# EAGLE design band-motor-feather (EAGLE 8.2.1)
DATABASE: /Users/ingolia/Dropbox/Experiments/turbidostat/nephelometer/circuitry/partsdb.txt
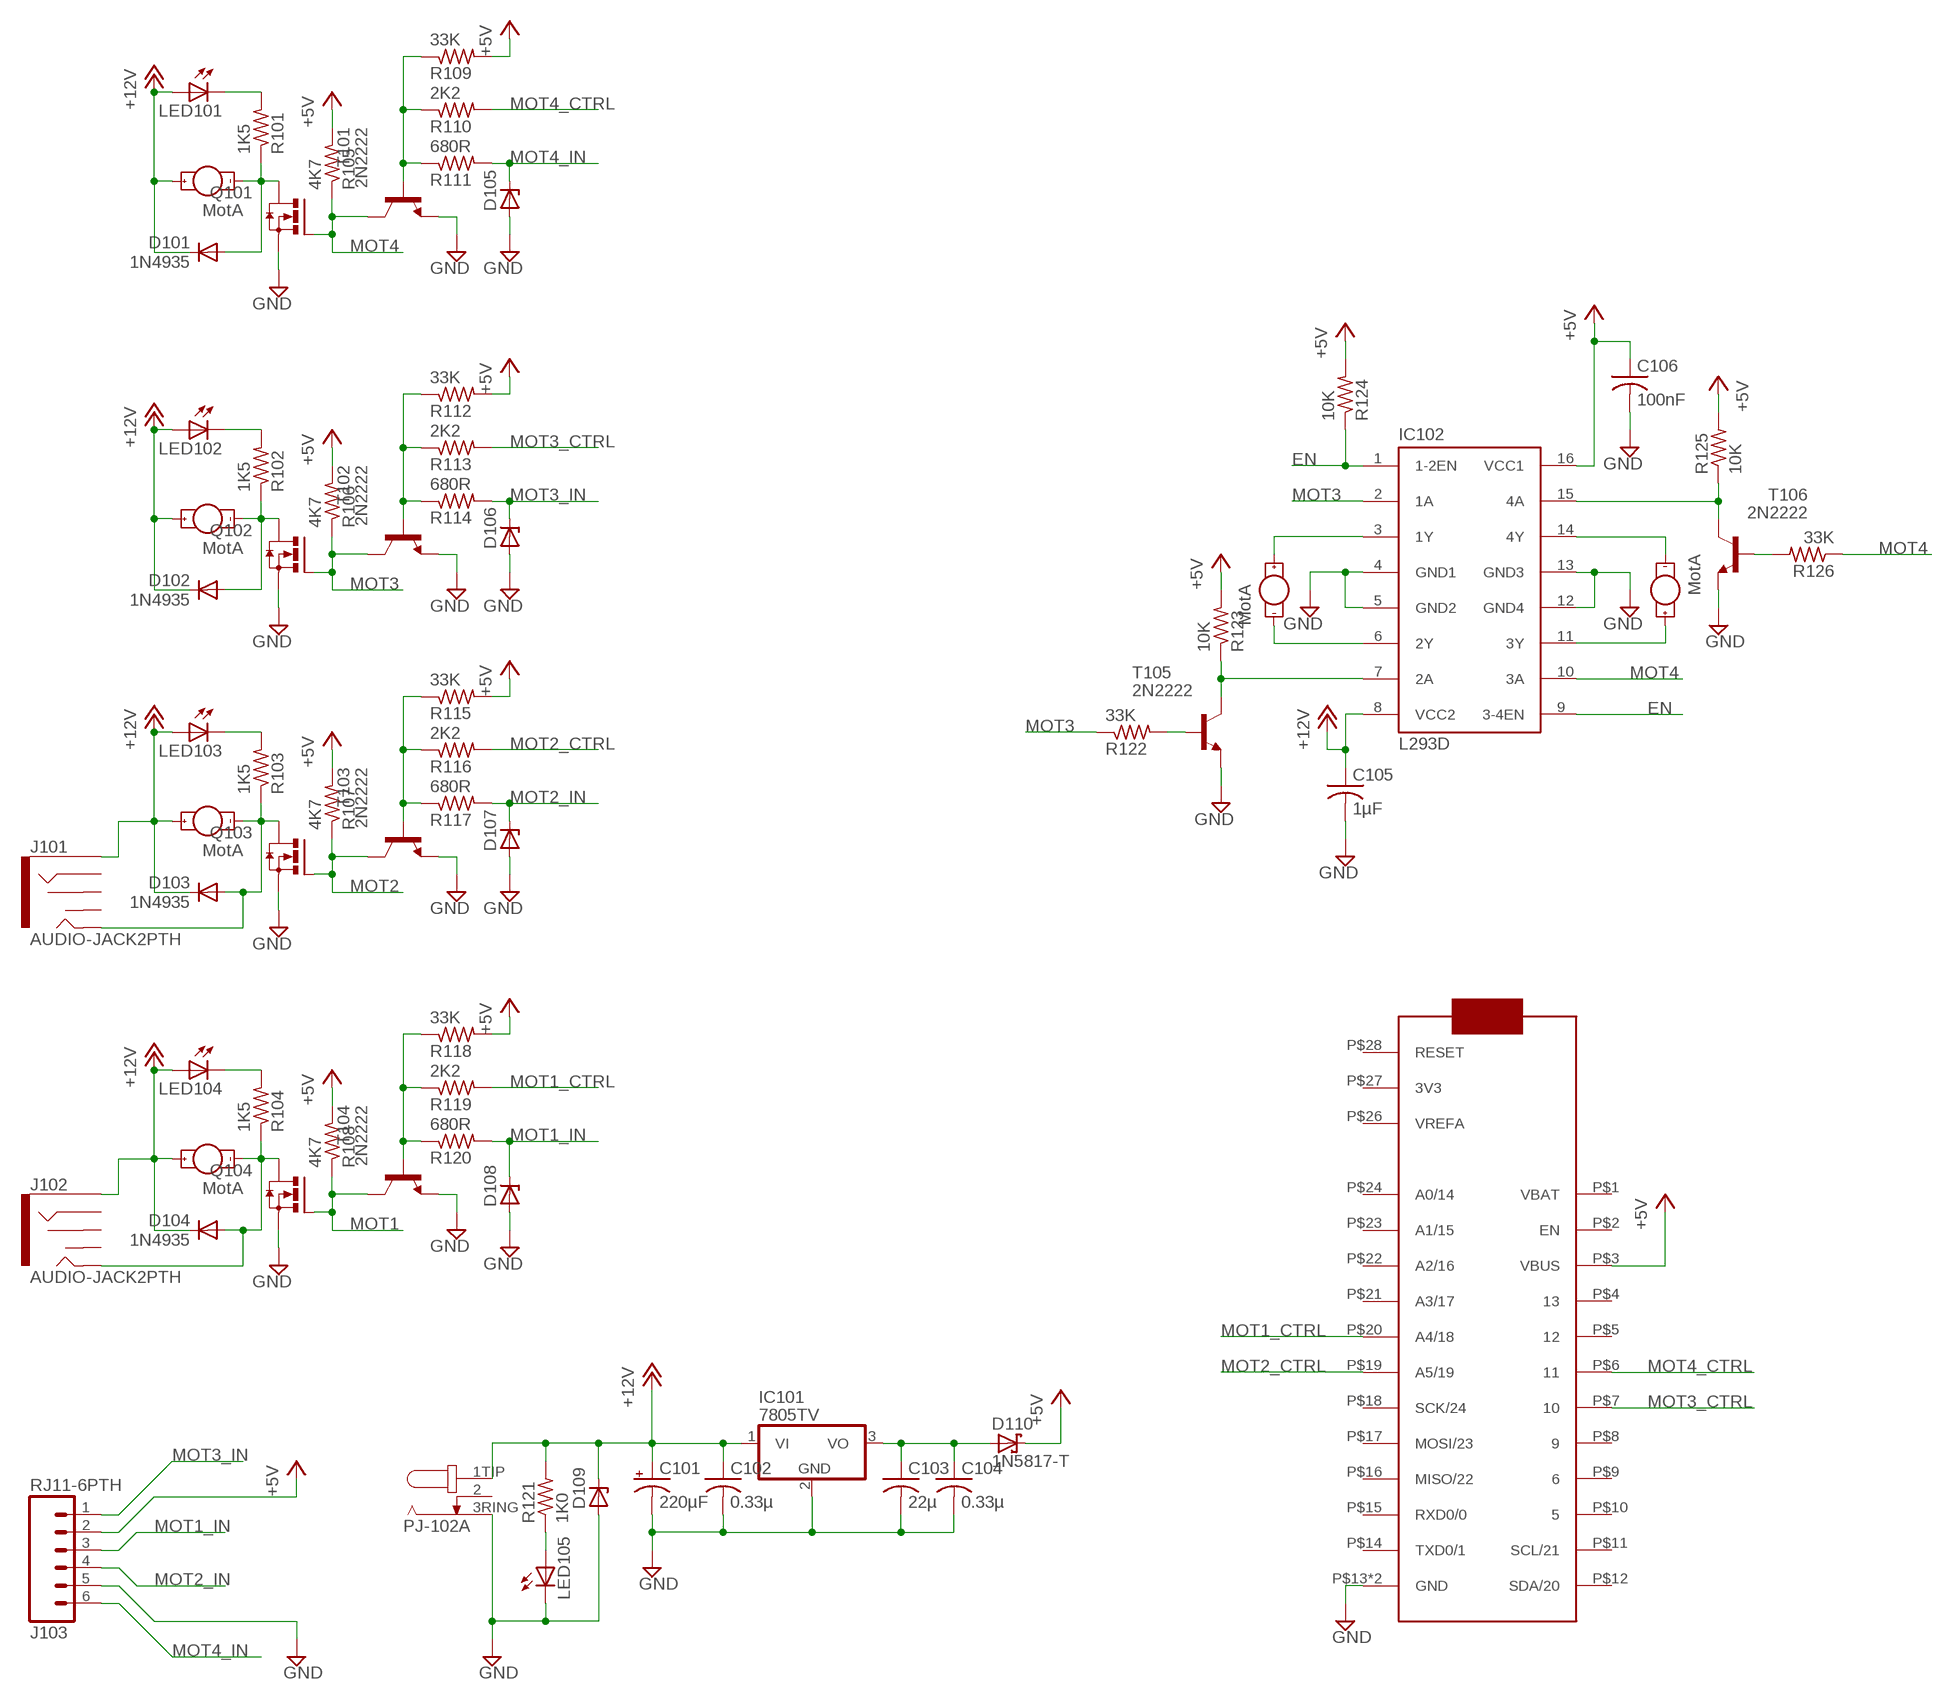
[diagram p0: schematic, sheet 1]

## Parts
C101  220µF  CPOL-USE3.5-8  [E3,5-8]
C102  0.33µ  C-US025-050X050  [C025-050X050]
C103  22µ  C-US050-045X075  [C050-045X075]
C104  0.33µ  C-US025-050X050  [C025-050X050]
C105  1µF  C-US025-025X050  [C025-025X050]
C106  100nF  C-US025-025X050  [C025-025X050]
D101  1N4935  1N4004  [DO41-10]
D102  1N4935  1N4004  [DO41-10]
D103  1N4935  1N4004  [DO41-10]
D104  1N4935  1N4004  [DO41-10]
D105  ZENER-DIODEF126-10  [F126Z10]
D106  ZENER-DIODEF126-10  [F126Z10]
D107  ZENER-DIODEF126-10  [F126Z10]
D108  ZENER-DIODEF126-10  [F126Z10]
D109  ZENER-DIODEF126-10  [F126Z10]
D110  1N5817-T  [DO41-7.6]
IC101  7805TV  [TO220V]
IC102  L293D  [DIL16]
IC103  FEATHER_M0  [FEATHER_M0]
J101  AUDIO-JACK2PTH  [AUDIO-JACK]
J102  AUDIO-JACK2PTH  [AUDIO-JACK]
J103  RJ11-6PTH  [RJ11-6]
J104  MotA  1X02_3.5MM_MOT  [1X02_3.5MM_MOT]
J105  MotA  1X02_3.5MM_MOT  [1X02_3.5MM_MOT]
J106  MotA  1X02_3.5MM_MOT  [1X02_3.5MM_MOT]
J107  MotA  1X02_3.5MM_MOT  [1X02_3.5MM_MOT]
J108  PJ-102A  [PJ-102A]
J109  MotA  1X02_3.5MM_MOT  [1X02_3.5MM_MOT]
J110  MotA  1X02_3.5MM_MOT  [1X02_3.5MM_MOT]
LED101  LED3MM  [LED3MM]
LED102  LED3MM  [LED3MM]
LED103  LED3MM  [LED3MM]
LED104  LED3MM  [LED3MM]
LED105  LED5MM  [LED5MM]
Q101  IRLB8721  [TO220BV]
Q102  IRLB8721  [TO220BV]
Q103  IRLB8721  [TO220BV]
Q104  IRLB8721  [TO220BV]
R101  1K5  R-US_0207/10  [0207/10]
R102  1K5  R-US_0207/10  [0207/10]
R103  1K5  R-US_0207/10  [0207/10]
R104  1K5  R-US_0207/10  [0207/10]
R105  4K7  R-US_0207/10  [0207/10]
R106  4K7  R-US_0207/10  [0207/10]
R107  4K7  R-US_0207/10  [0207/10]
R108  4K7  R-US_0207/10  [0207/10]
R109  33K  R-US_0207/10  [0207/10]
R110  2K2  R-US_0207/10  [0207/10]
R111  680R  R-US_0207/10  [0207/10]
R112  33K  R-US_0207/10  [0207/10]
R113  2K2  R-US_0207/10  [0207/10]
R114  680R  R-US_0207/10  [0207/10]
R115  33K  R-US_0207/10  [0207/10]
R116  2K2  R-US_0207/10  [0207/10]
R117  680R  R-US_0207/10  [0207/10]
R118  33K  R-US_0207/10  [0207/10]
R119  2K2  R-US_0207/10  [0207/10]
R120  680R  R-US_0207/10  [0207/10]
R121  1K0  R-US_0207/9  [0207/9]
R122  33K  R-US_0207/10  [0207/10]
R123  10K  R-US_0207/10  [0207/10]
R124  10K  R-US_0207/10  [0207/10]
R125  10K  R-US_0207/10  [0207/10]
R126  33K  R-US_0207/10  [0207/10]
T101  2N2222  [TO92-EBC-OVAL]
T102  2N2222  [TO92-EBC-OVAL]
T103  2N2222  [TO92-EBC-OVAL]
T104  2N2222  [TO92-EBC-OVAL]
T105  2N2222  [TO92-EBC-OVAL]
T106  2N2222  [TO92-EBC-OVAL]

## Nets
+5V: C106.1 D110.C IC102.16(VCC1) IC103.P$3(VBUS) J103.2 R105.2 R106.2 R107.2 R108.2 R109.2 R112.2 R115.2 R118.2 R123.2 R124.2 R125.2
+12V: C101.+ C102.1 C105.1 D101.C D102.C D103.C D104.C D109.C IC101.1(VI) IC102.8(VCC2) J101.SLEEVE J102.SLEEVE J104.1A(+) J105.1A(+) J106.1A(+) J107.1A(+) J108.1TIP(3TIP) LED101.A LED102.A LED103.A LED104.A R121.2
EN: IC102.1(1-2EN) IC102.9(3-4EN) R124.1
GND: C101.- C102.2 C103.2 C104.2 C105.2 C106.2 D105.A D106.A D107.A D108.A D109.A IC101.2(GND) IC102.4(GND1) IC102.5(GND2) IC102.12(GND4) IC102.13(GND3) IC103.P$13(GND) IC103.P$25(GND) J103.5 J108.3RING(1RING) LED105.K(C) Q101.S Q102.S Q103.S Q104.S T101.E T102.E T103.E T104.E T105.E T106.E
MOT1: Q104.G R108.1 T104.C
MOT1_CTRL: IC103.P$20(A4/18) R119.2
MOT1_IN: D108.C J103.3 R120.2
MOT2: Q103.G R107.1 T103.C
MOT2_CTRL: IC103.P$19(A5/19) R116.2
MOT2_IN: D107.C J103.4 R117.2
MOT3: IC102.2(1A) Q102.G R106.1 R122.1 T102.C
MOT3_CTRL: IC103.P$7 R113.2
MOT3_IN: D106.C J103.1 R114.2
MOT4: IC102.10(3A) Q101.G R105.1 R126.1 T101.C
MOT4_CTRL: IC103.P$6 R110.2
MOT4_IN: D105.C J103.6 R111.2
N$1: LED105.A R121.1
N$2: C103.1 C104.1 D110.A IC101.3(VO)
N$3: D103.A J101.TIP J106.2K(-) Q103.D R103.1
N$4: D104.A J102.TIP J107.2K(-) Q104.D R104.1
N$5: LED104.K(C) R104.2
N$6: R118.1 R119.1 R120.1 T104.B
N$7: LED103.K(C) R103.2
N$8: R112.1 R113.1 R114.1 T102.B
N$9: R109.1 R110.1 R111.1 T101.B
N$10: R115.1 R116.1 R117.1 T103.B
N$11: IC102.15(4A) R125.1 T106.C
N$12: R126.2 T106.B
N$13: IC102.7(2A) R123.1 T105.C
N$14: R122.2 T105.B
N$15: IC102.3(1Y) J109.1A(+)
N$16: IC102.6(2Y) J109.2K(-)
N$18: IC102.14(4Y) J110.2K(-)
N$19: IC102.11(3Y) J110.1A(+)
N$20: D102.A J105.2K(-) Q102.D R102.1
N$21: LED102.K(C) R102.2
N$22: D101.A J104.2K(-) Q101.D R101.1
N$23: LED101.K(C) R101.2
Unconnected: IC103.P$1(VBAT) IC103.P$2(EN) IC103.P$4 IC103.P$5 IC103.P$8 IC103.P$9 IC103.P$10 IC103.P$11(SCL/21) IC103.P$12(SDA/20) IC103.P$14(TXD0/1) IC103.P$15(RXD0/0) IC103.P$16(MISO/22) IC103.P$17(MOSI/23) IC103.P$18(SCK/24) IC103.P$21(A3/17) IC103.P$22(A2/16) IC103.P$23(A1/15) IC103.P$24(A0/14) IC103.P$26(VREFA) IC103.P$27(3V3) IC103.P$28(RESET) J101.RING J101.RSH J101.TSH J102.RING J102.RSH J102.TSH J108.2

## Library data of the parts
C101 = adafruit:CPOL-US: POLARIZED CAPACITOR, American symbol; DIGIKEY#: P5166-ND; MANF: Panasonic Electronic Components; MANF#: ECA-1VM221
C102 C104 = adafruit:C-US: CAPACITOR, American symbol; DIGIKEY#: 445-5312-ND; MANF: TDK Corporation; MANF#: FK14X7R1H334K
C103 = adafruit:C-US: CAPACITOR, American symbol; DIGIKEY#: 445-8455-ND; MANF: TDK Corporation; MANF#: FK20X7R1C226M
C105 = adafruit:C-US: CAPACITOR, American symbol; DIGIKEY#: 445-5318-ND; MANF: TDK Corporation; MANF#: FK14X7R1C105K
C106 = adafruit:C-US: CAPACITOR, American symbol; DIGIKEY#: BC1084CT-ND; MANF: Vishay BC Components; MANF#: K104K15X7RF5TL2
D101-D104 = adafruit:1N4004: DIODE General purpose 1N400x type rectifier (With bigger pads) http://www.ladyada.net/library/pcb/eaglelibrary.html; DIGIKEY#: 1N4935FSCT-ND; MANF: Fairchild Semiconductor; MANF#: 1N4935
D105-D108 = diode:ZENER-DIODE: Z-Diode; DIGIKEY#: SA5.0ALFCT-ND; MANF: Littelfuse Inc.; MANF#: SA5.0A
D109 = diode:ZENER-DIODE: Z-Diode; DIGIKEY#: SA12ALFCT-ND; MANF: Littelfuse Inc.; MANF#: SA12A
D110 = diode:1N581*: 1.0A SCHOTTKY BARRIER RECTIFIER Source: http://www.diodes.com/datasheets/ds23001.pdf; DIGIKEY#: 1N5817FSCT-ND; MANF: Fairchild Semiconductor; MANF#: 1N5817
IC101 = linear:78*: Positive VOLTAGE REGULATOR Source: http://cache.national.com/ds/LM/LM78L05.pdf http://www.fairchildsemi.com/ds/LM/LM7805.pdf; DIGIKEY#: LM7805CT-ND; MANF: Fairchild Semiconductor; MANF#: LM7805CT
IC102 = st-microelectronics:L293D: PUSH-PULL 4 CHANNEL DRIVER; DIGIKEY#: 296-9518-5-ND; MANF: Texas Instruments; MANF#: L293DNE; MPN: L293D; OC_FARNELL: 9589619; OC_NEWARK: 56P8249
IC103 = ingolia:FEATHER_M0; DIGIKEY#: 2830-ND; MANF: Adafruit Industries LLC; MANF#: 2830
J101 J102 = SparkFun-Connectors:AUDIO-JACK2: Stereo audio jack with bypass switches.; DIGIKEY#: CP1-3523N-ND; MANF: CUI Inc.; MANF#: SJ1-3523N
J103 = SparkFun-Connectors:RJ11-6: RJ11 Jack Simple 6 pin RJ11 jack. Commonly found on CAT3 devices and Microchip programmers. SKU: PRT-00132; DIGIKEY#: AE10383-ND; MANF: Assmann WSW Components; MANF#: -2004-1-4-LP-N-R
J104-J107 J109 J110 = ingolia:1X02_3.5MM_MOT; DIGIKEY#: ED2740-ND; MANF: On Shore Technology Inc.; MANF#: OSTTE020104
J108 = ingolia:PJ-102A; DIGIKEY#: CP-102A-ND; MANF: CUI Inc.; MANF#: PJ-102A
LED101-LED104 = adafruit:LED: LED OSRAM: - CHIPLED LG R971, LG N971, LY N971, LG Q971, LY Q971, LO R971, LY R971 LH N974, LH R974 LS Q976, LO Q976, LY Q976 LO Q996 - Hyper CHIPLED LW Q18S LB Q993, LB Q99A, LB R99A - SideLED LS A670, LO A670, LY A670, LG A670, LP A670 LB A673, LV A673, LT A673, LW A673 LH A674 LY A675 LS A676, LA A676, LO A676, LY A676, LW A676 LS A679, LY A679, LG A679 - Hyper Micro SIDELED® LS Y876, LA Y876, LO Y876, LY Y876 LT Y87S - SmartLED LW L88C, LW L88S LB L89C, LB L89S, LG L890 LS L89K, LO L89K, LY L89K LS L896, LA L896, LO L896, LY L896 - TOPLED LS T670, LO T670, LY T670, LG T670, LP T670 LSG T670, LSP T670, LSY T670, LOP T670, LYG T670 LG T671, LOG T671, LSG T671 LB T673, LV T673, LT T673, LW T673 LH T674 LS T676, LA T676, LO T676, LY T676, LB T676, LH T676, LSB T676, LW T676 LB T67C, LV T67C, LT T67C, LS T67K, LO T67K, LY T67K, LW E67C LS E67B, LA E67B, LO E67B, LY E67B, LB E67C, LV E67C, LT E67C LW T67C LS T679, LY T679, LG T679 LS T770, LO T770, LY T770, LG T770, LP T770 LB T773, LV T773, LT T773, LW T773 LH T774 LS E675, LA E675, LY E675, LS T675 LS T776, LA T776, LO T776, LY T776, LB T776 LHGB T686 LT T68C, LB T68C - Hyper Mini TOPLED® LB M676 - Mini TOPLED Santana® LG M470 LS M47K, LO M47K, LY M47K Source: http://www.osram.convergy.de/; DIGIKEY#: 754-1275-ND; MANF: Kingbright; MANF#: WP7113SRD/D
LED105 = adafruit:LED: LED OSRAM: - CHIPLED LG R971, LG N971, LY N971, LG Q971, LY Q971, LO R971, LY R971 LH N974, LH R974 LS Q976, LO Q976, LY Q976 LO Q996 - Hyper CHIPLED LW Q18S LB Q993, LB Q99A, LB R99A - SideLED LS A670, LO A670, LY A670, LG A670, LP A670 LB A673, LV A673, LT A673, LW A673 LH A674 LY A675 LS A676, LA A676, LO A676, LY A676, LW A676 LS A679, LY A679, LG A679 - Hyper Micro SIDELED® LS Y876, LA Y876, LO Y876, LY Y876 LT Y87S - SmartLED LW L88C, LW L88S LB L89C, LB L89S, LG L890 LS L89K, LO L89K, LY L89K LS L896, LA L896, LO L896, LY L896 - TOPLED LS T670, LO T670, LY T670, LG T670, LP T670 LSG T670, LSP T670, LSY T670, LOP T670, LYG T670 LG T671, LOG T671, LSG T671 LB T673, LV T673, LT T673, LW T673 LH T674 LS T676, LA T676, LO T676, LY T676, LB T676, LH T676, LSB T676, LW T676 LB T67C, LV T67C, LT T67C, LS T67K, LO T67K, LY T67K, LW E67C LS E67B, LA E67B, LO E67B, LY E67B, LB E67C, LV E67C, LT E67C LW T67C LS T679, LY T679, LG T679 LS T770, LO T770, LY T770, LG T770, LP T770 LB T773, LV T773, LT T773, LW T773 LH T774 LS E675, LA E675, LY E675, LS T675 LS T776, LA T776, LO T776, LY T776, LB T776 LHGB T686 LT T68C, LB T68C - Hyper Mini TOPLED® LB M676 - Mini TOPLED Santana® LG M470 LS M47K, LO M47K, LY M47K Source: http://www.osram.convergy.de/; DIGIKEY#: 754-1735-ND; MANF: Kingbright; MANF#: WP7113SGD
Q101-Q104 = ingolia:IRLB8721; DIGIKEY#: IRLB8721PBF-ND; MANF: International Rectifier; MANF#: IRLB8721PBF
R101-R104 = adafruit:R-US_: RESISTOR, American symbol; DIGIKEY#: CF14JT1K50CT-ND; MANF: Stackpole Electronics Inc; MANF#: CF14JT330R
R105-R108 = adafruit:R-US_: RESISTOR, American symbol; DIGIKEY#: CF14JT4K70CT-ND; MANF: Stackpole Electronics Inc; MANF#: CF14JT4K70
R109 R112 R115 R118 R122 R126 = adafruit:R-US_: RESISTOR, American symbol; DIGIKEY#: CF14JT33K0CT-ND; MANF: Stackpole Electronics Inc; MANF#: CF14JT33K0
R110 R113 R116 R119 = adafruit:R-US_: RESISTOR, American symbol; DIGIKEY#: CF14JT2K20CT-ND; MANF: Stackpole Electronics Inc; MANF#: CF14JT2K20
R111 R114 R117 R120 = adafruit:R-US_: RESISTOR, American symbol; DIGIKEY#: CF14JT680RCT-ND; MANF: Stackpole Electronics Inc; MANF#: CF14JT680R
R121 = adafruit:R-US_: RESISTOR, American symbol; DIGIKEY#: S1KHCT-ND; MANF: Stackpole Electronics Inc.; MANF#: CFM12JT1K00
R123-R125 = adafruit:R-US_: RESISTOR, American symbol; DIGIKEY#: CF14JT10K0CT-ND; MANF: Stackpole Electronics Inc; MANF#: CF14JT10K0
T101-T106 = adafruit:2N2222: NPN TRANSISTOR Big oval pads; DIGIKEY#: PN2222ATFCT-ND; MANF: Fairchild Semiconductor; MANF#: PN2222ATF

## Board
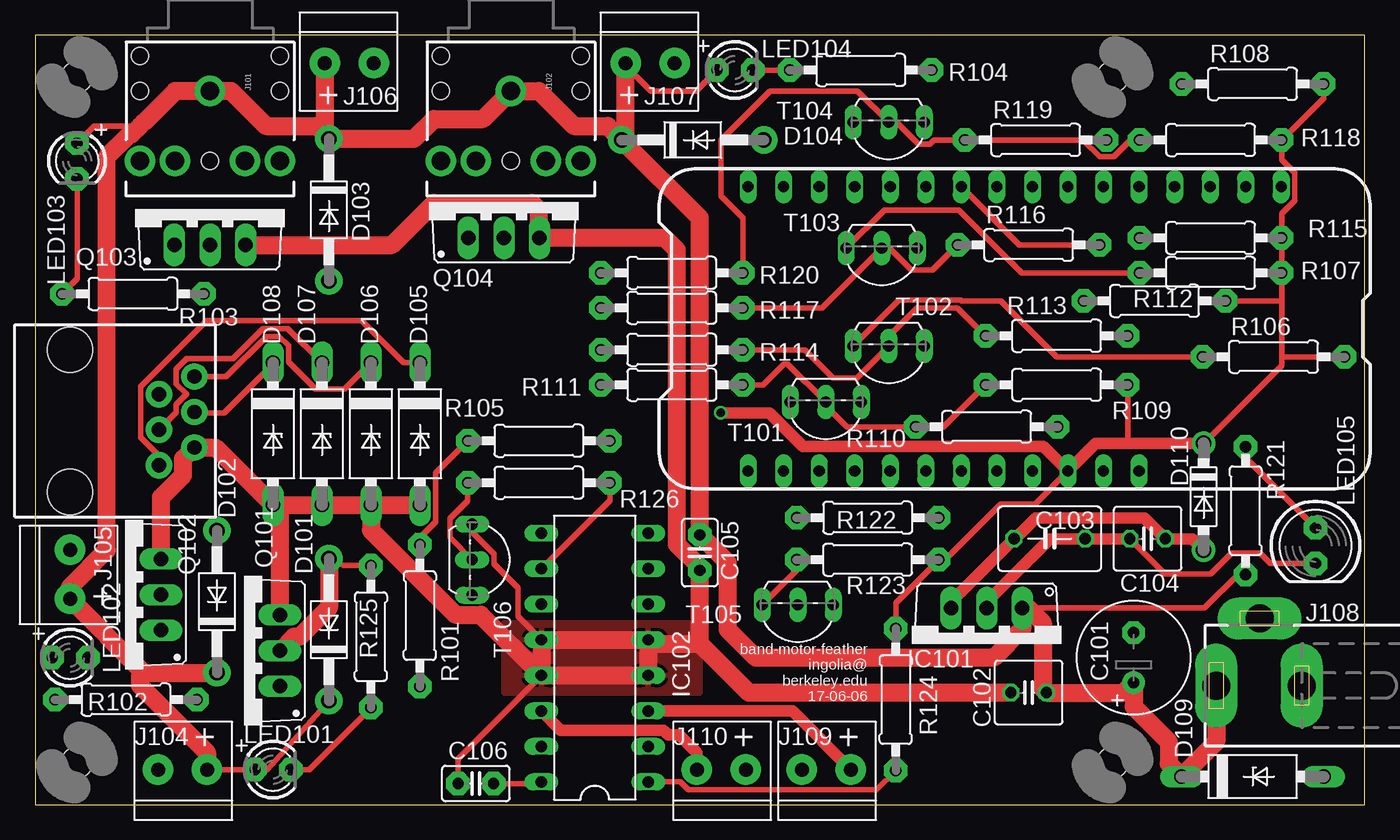
[diagram p1: board, top side]
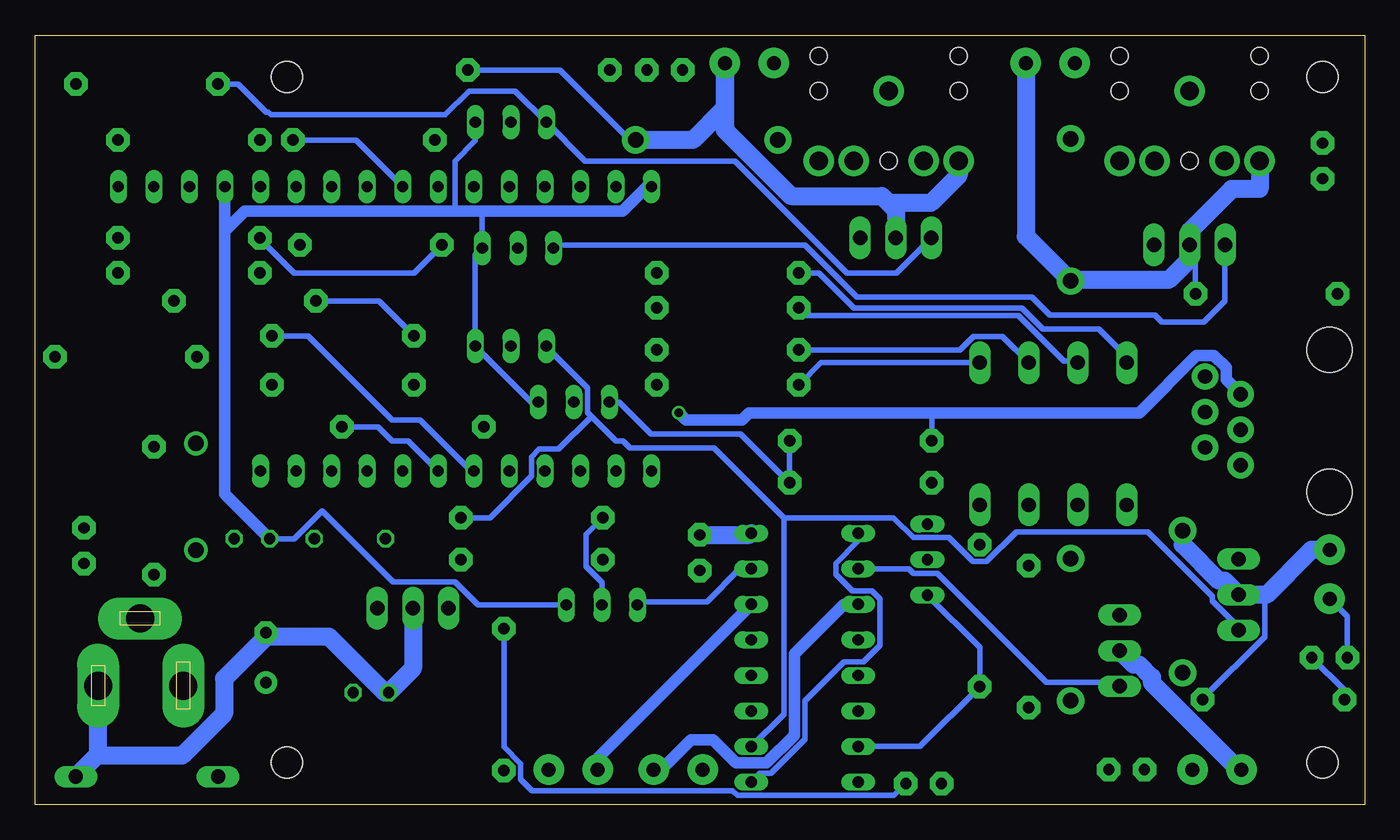
[diagram p2: board, bottom side, seen from below]

Size 95 x 55 mm. Coordinates in mm from the lower left corner, seen from the top.
Outline: 0,0 95,0 95,55 0,55 0,0
Copper layers (1*16): Top 0.0356mm / dielectric 1.5011mm / Bottom 0.0356mm
Design rules "OSHPark-LaenPCBOrder": minimum track width 6mil, minimum drill 13mil, track to track 6mil, track to pad 6mil, pad to pad 6mil, via to via 6mil, smd to smd 6mil, copper to edge 15mil, drill to drill 6mil, minimum pad ring 7mil, minimum via ring 7mil, stop-mask expansion 3mil, vias tented up to drill 0mil, thermal gap 10mil

### Footprints (pad centres in the part's own frame; a part is rotated, then mirrored left to right if it is on the bottom)
E3,5-8 = drill 0.813 pad 1.6: + -1.778,0 | drill 0.813 pad 1.6 octagon: - 1.778,0
C025-050X050 = drill 0.813 octagon: 1 -1.27,0; 2 1.27,0
C050-045X075 = drill 0.813 octagon: 1 -2.54,0; 2 2.54,0
C025-025X050 = drill 0.813 pad 1.676 octagon: 1 -1.27,0; 2 1.27,0
DO41-10 = drill 1.118 pad 1.93: A 5.08,0; C -5.08,0
F126Z10 = drill 1.016 long: A 5.08,0; C -5.08,0
DO41-7.6 = drill 1.1 pad 1.7: A 3.81,0; C -3.81,0
TO220V = drill 1.016 long: 1 -2.54,-2.54; 2 0,-2.54; 3 2.54,-2.54
DIL16 = drill 0.813 long: 1 -8.89,-3.81; 2 -6.35,-3.81; 3 -3.81,-3.81; 4 -1.27,-3.81; 5 1.27,-3.81; 6 3.81,-3.81; 7 6.35,-3.81; 8 8.89,-3.81; 9 8.89,3.81; 10 6.35,3.81; 11 3.81,3.81; 12 1.27,3.81; 13 -1.27,3.81; 14 -3.81,3.81; 15 -6.35,3.81; 16 -8.89,3.81
FEATHER_M0 = drill 0.8 long: P$1 -8.89,10.16; P$2 -6.35,10.16; P$3 -3.81,10.16; P$4 -1.27,10.16; P$5 1.27,10.16; P$6 3.81,10.16; P$7 6.35,10.16; P$8 8.89,10.16; P$9 11.43,10.16; P$10 13.97,10.16; P$11 16.51,10.16; P$12 19.05,10.16; P$13 19.05,-10.16; P$14 16.51,-10.16; P$15 13.97,-10.16; P$16 11.43,-10.16; P$17 8.89,-10.16; P$18 6.35,-10.16; P$19 3.81,-10.16; P$20 1.27,-10.16; P$21 -1.27,-10.16; P$22 -3.81,-10.16; P$23 -6.35,-10.16; P$24 -8.89,-10.16; P$25 -11.43,-10.16; P$26 -13.97,-10.16; P$27 -16.51,-10.16; P$28 -19.05,-10.16
AUDIO-JACK = drill 1.3 pad 2.184: RING 5,5; RSH 5,2.5; SLEEVE 0,0; TIP 5,-5; TSH 5,-2.5 | hole 1.2: 0,5; -2.5,5; -2.5,-5; 0,-5; 5,0
RJ11-6 = drill 1.016 pad 1.88: 1 1.905,8.89; 2 3.175,6.35; 3 4.445,8.89; 4 5.715,6.35; 5 6.985,8.89; 6 8.255,6.35 | hole 3.251: 0,0; 10.16,0
1X02_3.5MM_MOT = drill 1 pad 2.184: 1A 1.8,0; 2K -1.7,0
PJ-102A = drill 2 pad 2.54 long: 1TIP 0,3.1; 2 4.8,0; 3RING 0,-3
LED3MM = drill 0.813 pad 1.676 octagon: A -1.27,0; K 1.27,0
LED5MM = drill 0.813 pad 1.676 octagon: A -1.27,0; K 1.27,0
TO220BV = drill 1.016 long: D 0,0; G -2.54,0; S 2.54,0
0207/10 = drill 0.813 pad 1.676 octagon: 1 -5.08,0; 2 5.08,0
0207/9 = drill 0.813 pad 1.676 octagon: 1 -4.572,0; 2 4.572,0
TO92-EBC-OVAL = drill 0.813 long: B 0,-1.27; C 2.54,-1.27; E -2.54,-1.27
M2MOUNT = hole 2.2: 0,0

### Placement (x,y rotation side)
C101  78.5,10.5 90 top
C102  71,8 180 top
C103  72.5,19 0 top
C104  79.5,19 180 top
C105  47.5,18 270 top
C106  31.5,1.5 180 top
D101  21,12.5 90 top
D102  13,14.5 90 top
D103  21,42.5 270 top
D104  47,47.5 0 top
D105  27.5,26.5 270 top
D106  24,26.5 270 top
D107  20.5,26.5 270 top
D108  17,26.5 270 top
D109  87,2 0 top
D110  83.5,22 270 top
IC101  68,11.5 180 top
IC102  40,10.5 90 top
IC103  70,34 180 top
J101  12.5,51 270 top
J102  34,51 270 top
J103  2.5,32.5 270 top
J104  10.5,2.5 0 top
J105  2.5,16.5 270 top
J106  22.5,53 180 top
J107  44,53 180 top
J108  87.5,8.5 90 top
J109  56.5,2.5 0 top
J110  49,2.5 0 top
LED101  17,2.5 0 top
LED102  2.5,10.5 0 top
LED103  3,46 270 top
LED104  50,52.5 0 top
LED105  91.5,18.5 270 top
Q101  17.5,11 90 top
Q102  9,15 90 top
Q103  12.5,40 0 top
Q104  33.5,40.5 0 top
R101  24,12 270 top
R102  6.5,7.5 180 top
R103  7,36.5 180 top
R104  59,52.5 180 top
R105  36,26 180 top
R106  88.5,32 0 top
R107  84,38 0 top
R108  87,51.5 0 top
R109  73,30 0 top
R110  68,27 0 top
R111  45.5,30 180 top
R112  80,36 0 top
R113  73,33.5 0 top
R114  45.5,32.5 180 top
R115  84,40.5 0 top
R116  71,40 0 top
R117  45.5,35.5 180 top
R118  84,47.5 0 top
R119  71.5,47.5 0 top
R120  45.5,38 180 top
R121  86.5,21 270 top
R122  59.5,20.5 180 top
R123  59.5,17.5 0 top
R124  61.5,7.5 90 top
R125  27.5,13.5 90 top
R126  36,23 180 top
T101  56.5,27.5 180 top
T102  61,31.5 180 top
T103  60.5,38.5 180 top
T104  61,47.5 180 top
T105  54.5,13 180 top
T106  32.5,17.5 270 top
U$3  [M2MOUNT]  3,3 0 top
U$4  [M2MOUNT]  3,52 0 top
U$6  [M2MOUNT]  77,52 0 top
U$7  [M2MOUNT]  77,3 0 top

### Tracks (layer width: path | path; a pad name or v marks a point on that pad's centre or on a via)
+5V  (via drill 0.6)
  Top 0.406: D110.C 89.08,31.39 89.08,32 | 89.08,32 89.08,36 | R109.2 78.08,25.89 78,25.81 | R112.2 89.08,36 | IC103.P$3 71.47,21.5 69,21.5 65,17.5 R123.2 61.5,14.42 R124.2 | R108.2 92.08,50.5 R118.2 89.08,46.08 90.01,45.16 90.01,43.16 89.08,42.24 R115.2 R107.2 89.08,36 | R106.2 89.08,32 | R125.2 27.5,19.08 28.62,20.2 28.62,23.7 R105.2 | C106.1 36.08,1.5 IC102.16
  Top 0.813: D110.C 78,25.81 75.78,25.81 IC103.P$3 72.05,25.6 54.87,25.6 52.47,28 v49,28
  Bottom 0.406: R105.2 30.92,27.92 31,28 | C106.1 33.62,0.64 44.82,0.64 45.17,1 59.5,1 60.31,1.81 60.31,2.91 61.5,4.11 R124.2
  Bottom 0.813: J103.2 9.89,30.37 9.89,31.22 10.77,32.09 12.01,32.09 16.1,28 31,28 44,28 44.5,27.5 48.5,27.5 v49,28
+12V
  Top 0.406: IC101.1 83.54,14.04 86,16.5 86.43,16.5 R121.2 | J107.1A 42.2,52.8 44,51 47.23,51 LED104.A | 7.75,48.75 7.5,48.5 4.23,48.5 LED103.A | D101.C 16.58,2.5 LED101.A J104.1A
  Top 0.813: 84.5,8.5 J108.1TIP
  Top 1.27: J108.1TIP 84.4,4.48 D109.C 81,2.92 81,4.5 78.5,7 C101.+ 77.78,8 C102.1 72,8.27 72,13 70.96,14.04 IC101.1 70.54,12.54 68.5,10.5 51.5,10.5 49.5,12.5 49.5,17.27 C105.1 47.5,41.92 D104.C | D104.C 40.92,48.5 38.5,48.5 36,51 J102.SLEEVE 32,49 28.5,49 27.08,47.58 D103.C 20.54,48.04 | J107.1A 42.2,47.78 D104.C | 20.54,48.04 20.08,48.5 16.5,48.5 14,51 J101.SLEEVE 10,51 7.75,48.75 | J106.1A 20.7,48.2 20.54,48.04 | 7.5,48.5 6.88,47.88 6.72,47.88 5.14,46.3 5.14,18.18 2.5,15.54 J105.1A 7.78,9.42 | 7.78,9.42 D102.C | J104.1A 12.3,3.7 7.5,8.5 7.5,9.14 7.78,9.42
  Bottom 0.406: LED102.A 1.23,13.43 J105.1A
  Bottom 1.27: C105.1 43.93,19.27 IC102.8
EN
  Top 0.406: R124.1 60.13,1.05 46.7,1.05 46.14,1.61 IC102.1
  Bottom 0.406: IC102.1 43.2,2.22 42.4,2.22 39.98,4.64 39.98,7.42 37.2,10.2 35.79,10.2 34.62,11.37 34.62,14.71 35.18,15.27 36.59,15.27 37.77,16.45 37.77,17.25 36.19,18.82 IC102.9
GND
  Top 0.406: LED105.K 88.27,17.23 87.5,18 85.5,18 84,16.5 80.73,16.5 C104.2 | T106.E 31.23,19.48 32.8,17.9 32.8,17.2 34.5,15.5 34.5,13.46 IC102.12 | C106.2 30.23,3.27 IC102.13
  Top 0.813: IC101.2 68,14.5 72.5,19 C103.2 C104.2
  Top 1.27: Q103.S 25.5,40 28.5,43 35.5,43 36,42.5 36,40.54 Q104.S 45,40.5 45.87,39.63 45.87,18.6 47.5,16.97 C105.2 47.5,11.5 | 47.5,11.5 51,8 C102.2 | 47.5,11.5 44.08,11.5 IC102.5 | IC102.5 IC102.4 IC102.13 | IC102.13 IC102.12 IC102.5 | IC102.13 31.86,13.56 30.04,13.56 24,19.61 D106.A | D108.A 12.9,25.52 J103.5 10.58,24.7 10.58,23.53 9,21.95 Q102.S | D108.A D107.A D106.A | D106.A D105.A | Q101.S 17.5,20.92 D108.A
  Bottom 0.406: 63.54,42.36 63.5,42.4 | 63,42.4 63.04,42.36 T103.E 63.54,39.27 T102.E 59.54,28.77 T101.E | T104.E 63.54,47.46 65,46 65,42.4 | C104.2 76.5,19 74.5,21 69.42,15.92 65,15.92 63.35,14.27 T105.E
  Bottom 0.813: 81.43,41 IC103.P$25 | 81.43,41 81.43,22.2 C104.2 | IC103.P$13 51.25,44.16 53.01,42.4 63,42.4 63.5,42.4 65,42.4 80.03,42.4 81.43,41
  Bottom 1.27: 90.5,3.58 J108.3RING | 90.5,3.58 D109.A | 90.5,3.58 90.42,3.5 84.5,3.5 81.5,6.5 81.5,9 78.5,12 C101.- 78.22,12 74,12 70,8 C102.2 68,9.73 IC101.2
  pour Top: 33.5,13 47.5,13 47.5,8 33.5,8
MOT1
  Bottom 0.406: Q104.G 33.46,38 37,38 45,46 55.69,46 T104.C 60.69,51 64,51 65.7,49.3 78.12,49.3 78.32,49.5 78.5,49.5 80.5,51.5 R108.1
MOT1_CTRL
  Bottom 0.406: R119.2 72.07,47.5 IC103.P$20
MOT1_IN
  Top 0.406: D108.C 17,31.5 13.5,28 11.5,28 J103.3
  Bottom 0.406: R120.2 39,38 36.5,35.5 24.5,35.5 23,34 19,34 17,32 D108.C
MOT2
  Top 0.406: R107.1 70.5,38 66,42.5 60.69,42.5 T103.C
  Bottom 0.406: Q103.G 10,39.96 10,36 11.5,34.5 14.5,34.5 15,35 22.5,35 23.77,36.27 36.27,36.27 40,40 57.73,40 T103.C
MOT2_CTRL
  Top 0.406: R116.2 70.35,40 IC103.P$19
MOT2_IN
  Top 0.406: J103.4 10.1,28.03 10.1,28.59 10.83,29.33 10.1,30.06 10.1,31.13 10.85,31.89 14.18,31.89 16.31,34.02 18.06,34.02 D107.C
  Bottom 0.406: D107.C 21.13,31.71 21.5,31.71 24.73,34.94 39.86,34.94 R117.2
MOT3
  Top 0.406: R106.1 73,32 69,36 66.21,36 66.15,36.06 61.75,36.06 T102.C
  Bottom 0.406: 55.25,27.75 55.53,28.03 55.53,29.78 58.46,32.7 T102.C | 55.25,27.75 53.5,26 53,26 52.5,25.5 46.5,25.5 41.5,20.5 | 41.5,20.5 41.5,6.46 IC102.2 | 55.25,27.75 57.6,25.4 58.97,25.4 59.53,24.84 59.53,23.47 62.5,20.5 R122.1 | 41.5,20.5 33.66,20.5 32.24,19.07 29.68,19.07 27.99,17.39 27.01,17.39 24.89,19.5 15.5,19.5 10.88,14.88 10.88,14.54 9,12.66 Q102.G 9.04,12.5
MOT3_CTRL
  Bottom 0.406: IC103.P$7 63.84,23.84 67.5,27.5 69.5,27.5 75.5,33.5 R113.2
MOT3_IN
  Top 0.406: J103.1 13.67,30.59 16.54,33.46 17.46,33.46 18.12,32.8 18.12,31.62 20.04,29.7 22.12,29.7 D106.C
  Bottom 0.406: R114.2 28.92,32.5 27.96,33.46 25.88,33.46 D106.C
MOT4
  Top 0.406: R126.1 41.08,21.74 IC102.10
  Bottom 0.406: T101.C 53.27,28.77 51,26.5 44.58,26.5 R126.1 R105.1 | IC102.10 32.55,16.85 32.24,16.54 30.54,16.54 22.74,8.74 17.95,8.74 17.67,8.46 Q101.G
MOT4_CTRL
  Bottom 0.406: R110.2 70.5,27 69.5,26 68.35,26 IC103.P$6
MOT4_IN
  Top 0.406: D105.C 26.34,31.58 23.34,34.58 12.27,34.58 7.55,29.86 7.55,26.25 8.85,24.95 J103.6
  Bottom 0.406: D105.C 38.84,31.58 R111.2
N$1
  Top 0.406: R121.1 86.5,24.77 LED105.A
N$2
  Top 0.813: IC101.3 65.46,14.5 C103.1 70,19 71.5,20.5 79.27,20.5 C104.1 82.69,19 D110.A
N$3
  Bottom 0.406: R103.1 12.08,39.58 Q103.D
  Bottom 1.27: J101.TIP 7.5,44 9.5,44 12.5,41 Q103.D 12.5,39 14,37.5 20.92,37.5 D103.A 24.2,40.62 J106.2K
N$4
  Bottom 0.406: D104.A 52.5,47.5 57.5,52.5 R104.1
  Bottom 1.27: D104.A 48,47.5 45.7,49.8 J107.2K 45.7,48.2 41,43.5 34.5,43.5 34,43 | 34,43 33.5,42.5 Q104.D | J102.TIP 29,45 31,43 34,43
N$5
  Top 0.406: LED104.K R104.2
N$6
  Top 0.406: R120.1 50.58,41.92 49,43.5 49,47.5 52.5,51 58.77,51 T104.B 61.56,48.77 63.14,47.2 63.94,47.2 64.25,47.5 R119.1 74.89,47.5 76.09,46.31 77.07,46.31 78.27,47.5 R118.1
N$7
  Top 0.406: LED103.K 3,37.58 R103.2
N$8
  Top 0.406: R113.1 65.92,35.5 63,35.5 61,33.5 T102.B 58.73,30.5 57,30.5 55,32.5 R114.1
  Bottom 0.406: R112.1 70.42,36 R113.1
N$9
  Top 0.406: R109.1 64.92,27 R110.1 58,27 56.5,28.5 T101.B 53.77,31.5 53.5,31.5 52,30 R111.1
N$10
  Top 0.406: R117.1 56.23,35.5 T103.B 61.06,39.77 62.64,38.2 64.11,38.2 R116.1
  Bottom 0.406: R115.1 78.92,40.42 76.5,38 67.92,38 R116.1
N$11
  Bottom 0.406: IC102.15 31.77,4.15 R125.1 27.5,11.23 T106.C
N$12
  Top 0.406: R126.2 30.92,21.7 29.66,20.44 29.66,19.07 T106.B
N$13
  Top 0.406: R123.1 54.42,16.73 T105.C
  Bottom 0.406: IC102.7 44.65,16.85 47,14.5 51.73,14.5 T105.C
N$14
  Bottom 0.406: T105.B 54.5,15.89 55.61,17.01 55.61,19.31 R122.2
N$15
  Top 0.813: IC102.3 54.11,6.69 J109.1A
N$16
  Bottom 0.813: J109.2K 54.8,3.32 IC102.6
N$18
  Top 0.813: J110.2K 47.3,3.7 46,5 45.22,5 44.9,5.32 37.56,5.32 IC102.14
N$19
  Bottom 0.813: IC102.11 37.19,14.31 40.74,10.76 40.74,4.96 42.72,2.98 44.9,2.98 46.56,4.63 48.13,4.63 50.26,2.5 J110.1A
N$20
  Bottom 0.406: 7,15 7.12,14.88 7.12,12 11.58,7.54 R102.1
  Bottom 1.27: D102.A 13,18.59 10.4,15.99 9.99,15.99 Q102.D 7,15 3.8,18.2 J105.2K
N$21
  Bottom 0.406: R102.2 1.42,8.15 LED102.K
N$22
  Top 0.406: R101.1 22,17.08 D101.A
  Top 1.27: Q101.D 18.49,11.99 18.9,11.99 21,14.09 D101.A
  Bottom 1.27: J104.2K 9,2.5 15.19,8.69 15.19,9.1 16.1,10.01 16.51,10.01 Q101.D
N$23
  Top 0.406: LED101.K 19.58,2.5 R101.2

### Text on the board
tPlace: band-motor-feather / ingolia@ / berkeley.edu / 17-06-06